# Altium schematic sheet W5500_1.12.SchDoc
size A4
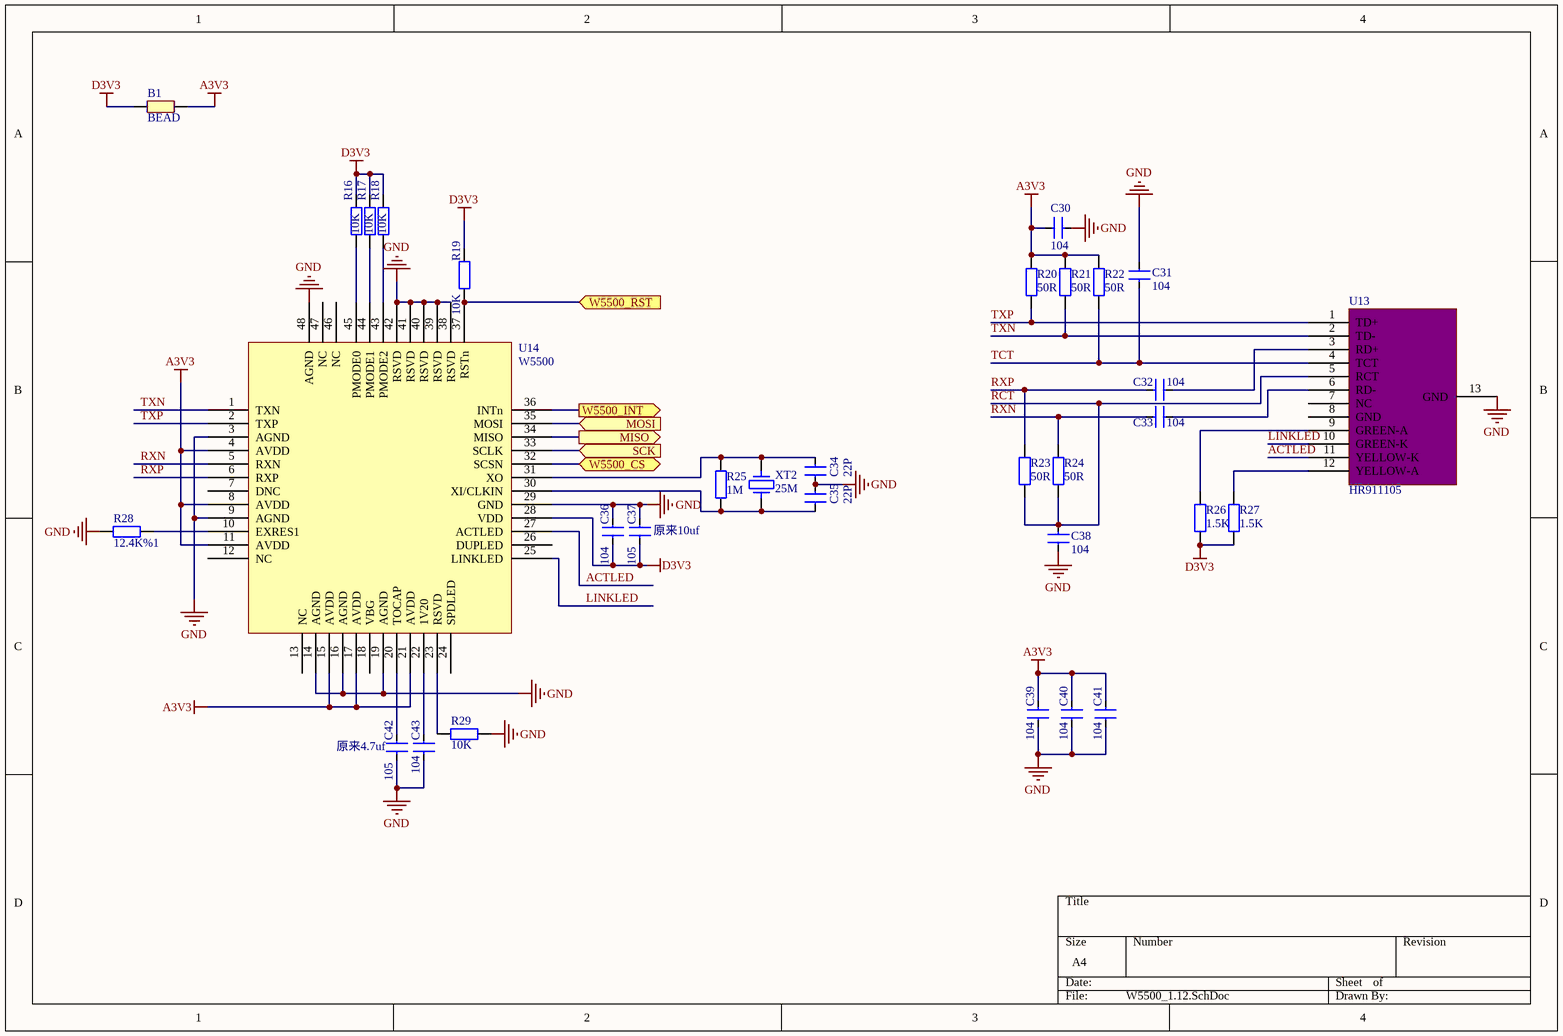
[diagram p0: W5500_1.12.SchDoc]

## Parts
B1  BEAD  [0603L]
C30  104  [0603C]
C31  104  [0603C]
C32  104  [0603C]
C33  104  [0603C]
C34  22P  [0603C]
C35  22P  [0603C]
C36  104  [0603C]
C37  105  [0603C]
C38  104  [0603C]
C39  104  [0603C]
C40  104  [0603C]
C41  104  [0603C]
C42  105  [0603C]
C43  104  [0603C]
R16  10K  [0603R]
R17  10K  [0603R]
R18  10K  [0603R]
R19  10K  [0603R]
R20  50R  [0603R]
R21  50R  [0603R]
R22  50R  [0603R]
R23  50R  [0603R]
R24  50R  [0603R]
R25  1M  [0603R]
R26  1.5K  [0603R]
R27  1.5K  [0603R]
R28  12.4K%1  [0603R]
R29  10K  [0603R]
U13  HR911105  [HR911105A]
U14  W5500  [LQFP48]
XT2  25M  [5032]

## Ports
MISO (out), MOSI (in), SCK (in), W5500_CS, W5500_INT (out), W5500_RST (in)

## Nets
A3V3: B1.2 C30.1 C39.2 C40.2 C41.2 R20.2 R21.2 R22.2 U14.4(AVDD) U14.8(AVDD) U14.11(AVDD) U14.15(AVDD) U14.17(AVDD) U14.21(AVDD)
D3V3: B1.1 C36.1 C37.1 R16.2 R17.2 R18.2 R19.2 R26.1 R27.1 U14.28(VDD)
GND: C30.2 C31.1 C34.1 C35.2 C36.2 C37.2 C38.2 C39.1 C40.1 C41.1 C42.1 C43.1 R28.2 R29.1 U13.13(GND) U14.3(AGND) U14.9(AGND) U14.14(AGND) U14.16(AGND) U14.19(AGND) U14.29(GND) U14.38(RSVD) U14.39(RSVD) U14.40(RSVD) U14.41(RSVD) U14.42(RSVD) U14.48(AGND)
ACTLED: U13.11(YELLOW-K) U14.27(ACTLED)
LINKLED: U13.10(GREEN-K) U14.25(LINKLED)
MISO: U14.34(MISO) ; port MISO
MOSI: U14.35(MOSI) ; port MOSI
RCT: C38.1 R23.2 R24.2 U13.5(RCT)
RXN: C33.2 R24.1 U14.5(RXN)
RXP: C32.2 R23.1 U14.6(RXP)
SCK: U14.33(SCLK) ; port SCK
TCT: C31.2 R22.1 U13.4(TCT)
TXN: R21.1 U13.2(TD-) U14.1(TXN)
TXP: R20.1 U13.1(TD+) U14.2(TXP)
W5500_CS: U14.32(SCSN) ; port W5500_CS
W5500_INT: U14.36(INTn) ; port W5500_INT
W5500_RST: R19.1 U14.37(RSTn) ; port W5500_RST
NetC32_1: C32.1 U13.3(RD+)
NetC33_1: C33.1 U13.6(RD-)
NetC34_2: C34.2 R25.2 U14.31(XO) XT2.2
NetC35_1: C35.1 R25.1 U14.30(XI/CLKIN) XT2.1
NetC42_2: C42.2 U14.20(TOCAP)
NetC43_2: C43.2 U14.22(1V20)
NetR16_1: R16.1 U14.45(PMODE0)
NetR17_1: R17.1 U14.44(PMODE1)
NetR18_1: R18.1 U14.43(PMODE2)
NetR26_2: R26.2 U13.9(GREEN-A)
NetR27_2: R27.2 U13.12(YELLOW-A)
NetR28_1: R28.1 U14.10(EXRES1)
NetR29_2: R29.2 U14.23(RSVD)

Not connected (* = marked no-connect by the designer): U13 7(NC) 8(GND); U14 7(DNC) 12(NC) 13(NC) 18(VBG) 24(SPDLED) 26(DUPLED) 46(NC) 47(NC)

## Notes on the sheet
- (near C37) 原来10uf
- (near C42) 原来4.7uf

## Library data of the parts
B1 = BEAD: 磁珠
C30-C43 = CAP: 普通小电容
R16-R29 = RES: 普通电阻
XT2 = XT: 晶振